# Altium schematic sheet Sheet4.SchDoc
size A
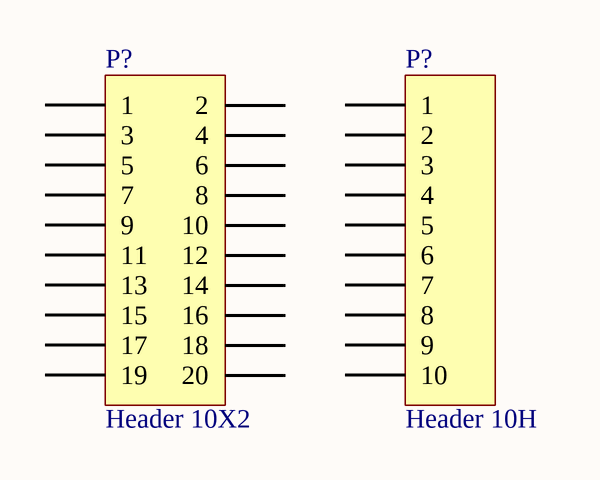
[diagram p0: Sheet4.SchDoc]

## Parts
(Parts that share a designator on the sheet are numbered #1, #2 ... from top to bottom, then left to right.)
P?#1  Header 10X2  [HDR2X10]
P?#2  Header 10H  [HDR1X10H]

## Nets

Not connected (* = marked no-connect by the designer): P?#1 1 2 3 4 5 6 7 8 9 10 11 12 13 14 15 16 17 18 19 20; P?#2 1 2 3 4 5 6 7 8 9 10

## Library data of the parts
P?#1 = Header 10X2: Header, 10-Pin, Dual row; LatestRevisionDate: 17-Jul-2002; LatestRevisionNote: Re-released for DXP Platform.; Publisher: Altium Limited
P?#2 = Header 10H: Header, 10-Pin, Right Angle; LatestRevisionDate: 17-Jul-2002; LatestRevisionNote: Re-released for DXP Platform.; Publisher: Altium Limited